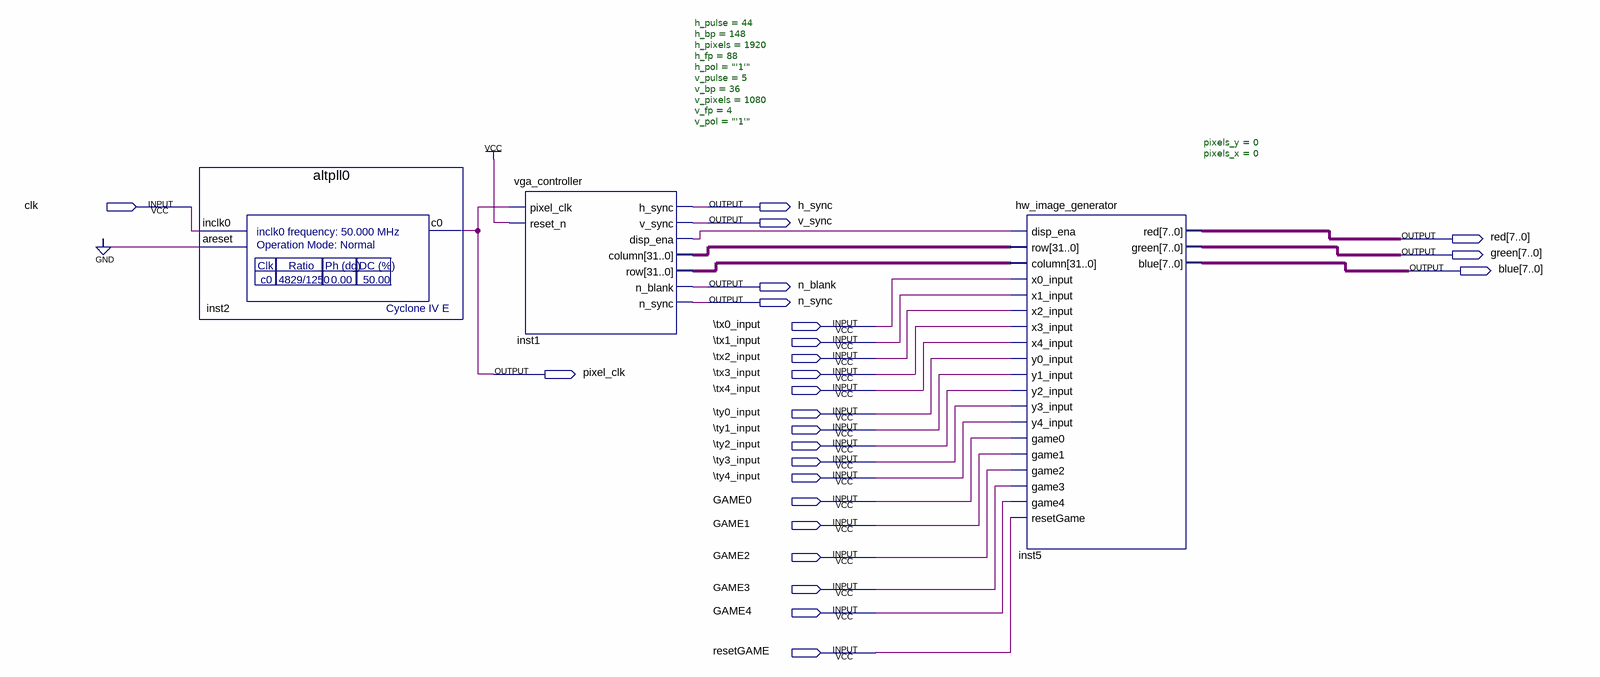
[diagram p0: schematic sheet]
// Quartus schematic vga_with_hw_test_image.bdf as structural Verilog: 3 symbols, 25 pins
module vga_with_hw_test_image (
  input  clk,
  input  \\tx0_input ,
  input  \\tx1_input ,
  input  \\tx2_input ,
  input  \\tx3_input ,
  input  \\tx4_input ,
  input  \\ty0_input ,
  input  \\ty1_input ,
  input  \\ty2_input ,
  input  \\ty3_input ,
  input  \\ty4_input ,
  input  GAME0,
  input  GAME1,
  input  GAME2,
  input  GAME3,
  input  GAME4,
  input  resetGAME,
  output h_sync,
  output v_sync,
  output [7:0] red,
  output [7:0] green,
  output [7:0] blue,
  output n_blank,
  output n_sync,
  output pixel_clk
);

  wire inst1_disp_ena;
  wire [31:0] inst1_column, inst1_row;

  altpll0 inst2 (.inclk0(clk), .areset(1'b0), .c0(pixel_clk));
  vga_controller #(.h_pulse(44), .h_bp(148), .h_pixels(1920), .h_fp(88), .h_pol("'1'"), .v_pulse(5), .v_bp(36), .v_pixels(1080), .v_fp(4), .v_pol("'1'")) inst1 (
    .pixel_clk(pixel_clk), .reset_n(1'b1), .h_sync(h_sync), .v_sync(v_sync), .disp_ena(inst1_disp_ena),
    .column(inst1_column), .row(inst1_row), .n_blank(n_blank), .n_sync(n_sync));
  hw_image_generator #(.pixels_y(0), .pixels_x(0)) inst5 (
    .disp_ena(inst1_disp_ena), .row(inst1_column), .column(inst1_row), .x0_input(\\tx0_input ),
    .x1_input(\\tx1_input ), .x2_input(\\tx2_input ), .x3_input(\\tx3_input ), .x4_input(\\tx4_input ),
    .y0_input(\\ty0_input ), .y1_input(\\ty1_input ), .y2_input(\\ty2_input ), .y3_input(\\ty3_input ),
    .y4_input(\\ty4_input ), .game0(GAME0), .game1(GAME1), .game2(GAME2), .game3(GAME3), .game4(GAME4),
    .resetGame(resetGAME), .red(red), .green(green), .blue(blue));
endmodule
